# EAGLE design Schaltplan (EAGLE 9.6.2)
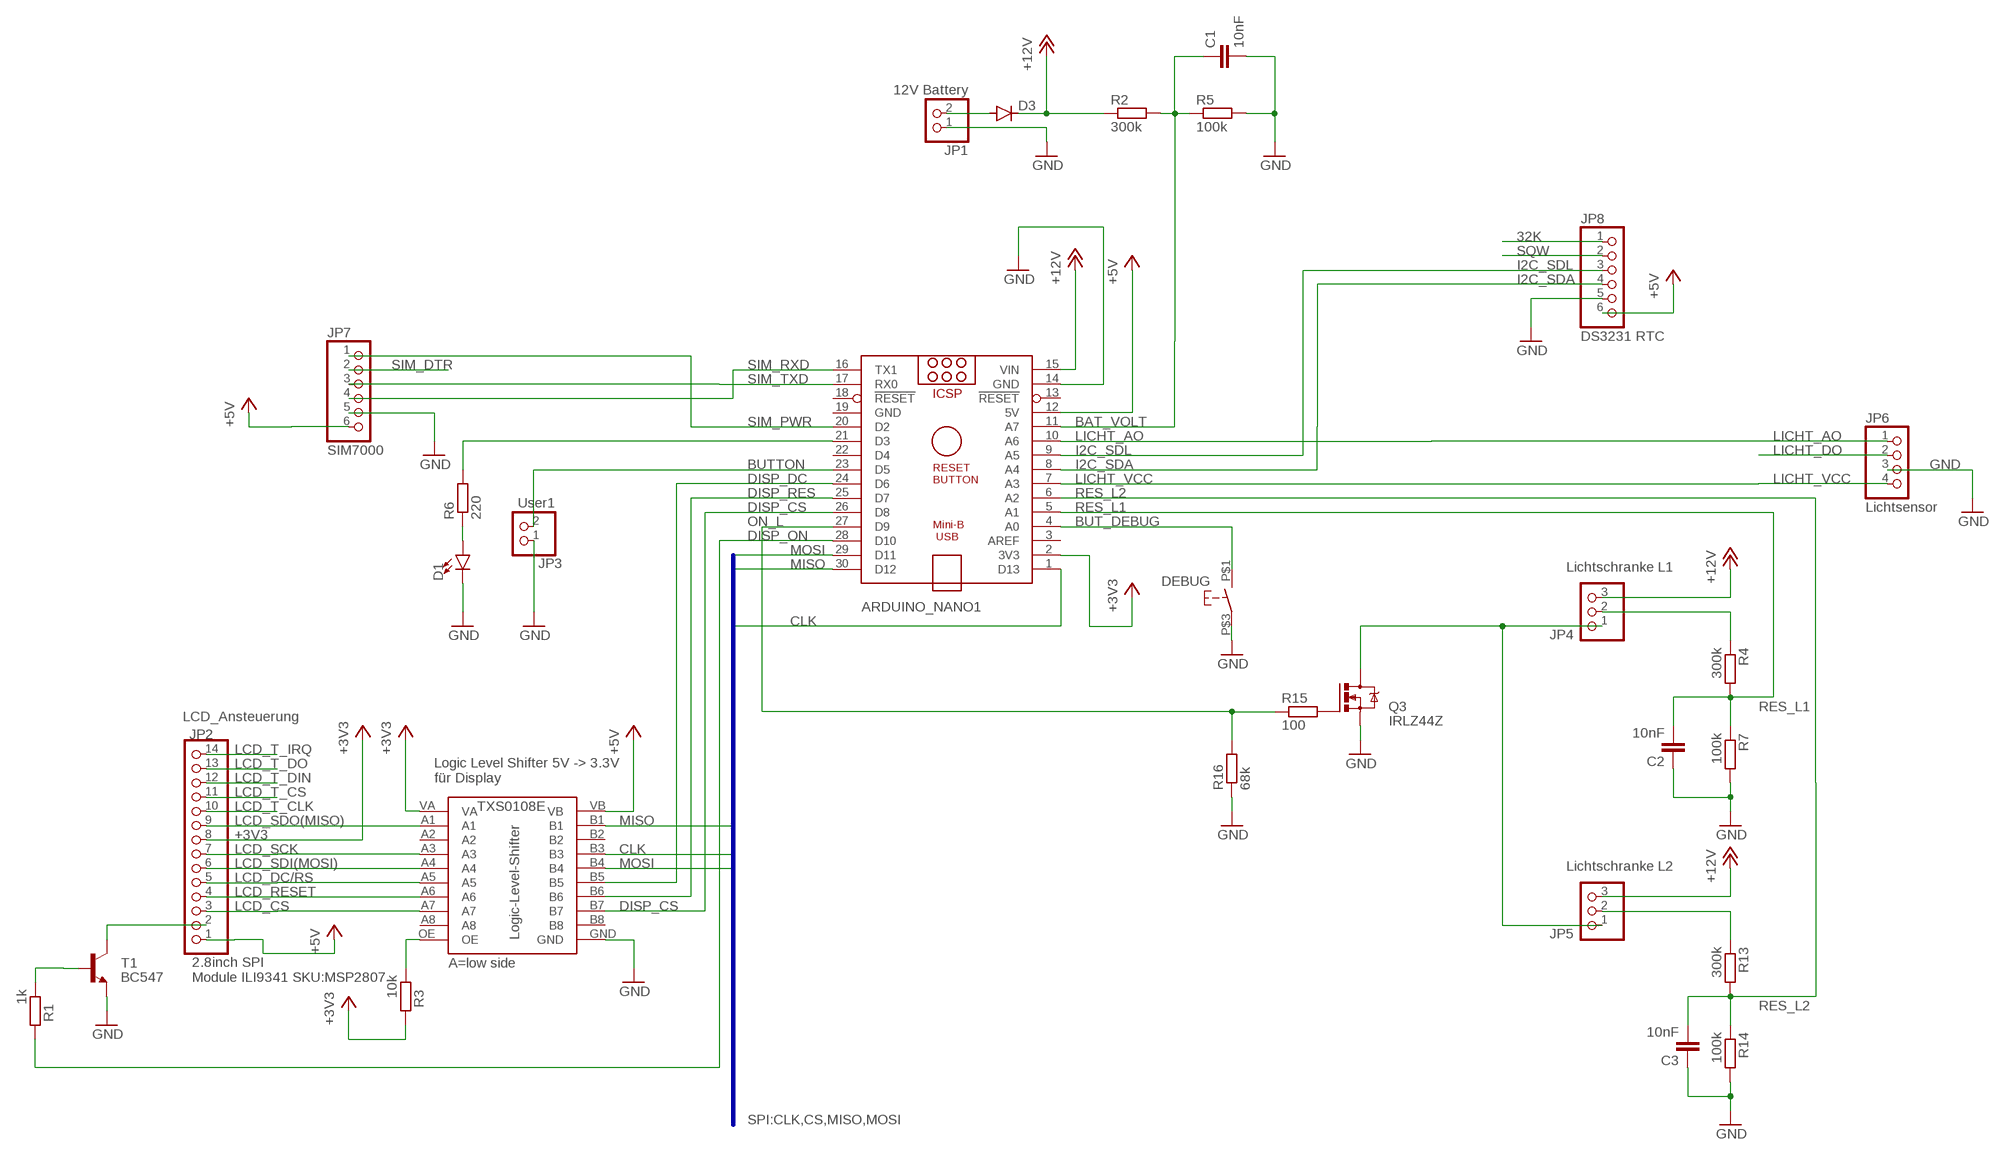
[diagram p0: schematic, sheet 1]

## Parts
ARDUINO_NANO1  ARDUINO_NANO  [ARDUINO_NANO]
C1  10nF  C-EUC0805K  [C0805K]
C2  10nF  C-EUC0805K  [C0805K]
C3  10nF  C-EUC0805K  [C0805K]
D1  LED5MM  [LED_5MM]
D3  1N4004  [DO41-10]
DEBUG  SCHLIESSER_TASTSCHALTER  [B3F-10XX]
JP1  12V Battery  PINHD-1X2  [1X02]
JP2  LCD_Ansteuerung  PINHD-1X14  [1X14]
JP3  User1  PINHD-1X2  [1X02]
JP4  Lichtschranke L1  PINHD-1X3  [1X03]
JP5  Lichtschranke L2  PINHD-1X3  [1X03]
JP6  Lichtsensor  PINHD-1X4  [1X04]
JP7  SIM7000  PINHD-1X6  [1X06]
JP8  DS3231 RTC  PINHD-1X6  [1X06]
Q3  IRLZ44Z  [TO220BH]
R1  1k  R-EU_R1206  [R1206]
R2  300k  R-EU_R1206  [R1206]
R3  10k  R-EU_R1206  [R1206]
R4  300k  R-EU_R1206  [R1206]
R5  100k  R-EU_R1206  [R1206]
R6  220  R-EU_R1206  [R1206]
R7  100k  R-EU_R1206  [R1206]
R13  300k  R-EU_R1206  [R1206]
R14  100k  R-EU_R1206  [R1206]
R15  100  R-EU_R1206  [R1206]
R16  68k  R-EU_R1206  [R1206]
T1  BC547  [TO92]
U$2  TXS0108E_LOGIC_LEVEL_SHIFTER  [TXS0108E_LOGIC_LEVEL_SHIFTER]

## Nets
32K: JP8.1
+3V3: ARDUINO_NANO1.2(3V3) JP2.8 R3.2 U$2.VA
+5V: ARDUINO_NANO1.12(5V) JP2.1 JP7.6 JP8.6 U$2.VB
+12V: ARDUINO_NANO1.15(VIN) D3.C JP4.3 JP5.3 R2.1
BAT_VOLT: ARDUINO_NANO1.11(A7) C1.1 R2.2 R5.1
BUT_DEBUG: ARDUINO_NANO1.4(A0) DEBUG.P$1
BUTTON: ARDUINO_NANO1.23(D5) JP3.2
CLK: ARDUINO_NANO1.1(D13) U$2.B3
DISP_CS: ARDUINO_NANO1.26(D8) U$2.B7
DISP_DC: ARDUINO_NANO1.24(D6) U$2.B5
DISP_ON: ARDUINO_NANO1.28(D10) R1.2
DISP_RES: ARDUINO_NANO1.25(D7) U$2.B6
GND: ARDUINO_NANO1.14(GND) C1.2 C2.1 C3.1 D1.K(C) DEBUG.P$3 JP1.1 JP3.1 JP6.3 JP7.5 JP8.5 Q3.S R5.2 R7.2 R14.2 R16.1 T1.1(E) U$2.GND
I2C_SDA: ARDUINO_NANO1.8(A4) JP8.4
I2C_SDL: ARDUINO_NANO1.9(A5) JP8.3
LCD_CS: JP2.3 U$2.A7
LCD_DC/RS: JP2.5 U$2.A5
LCD_RESET: JP2.4 U$2.A6
LCD_SCK: JP2.7 U$2.A3
LCD_SDI(MOSI): JP2.6 U$2.A4
LCD_SDO(MISO): JP2.9 U$2.A1
LCD_T_CLK: JP2.10
LCD_T_CS: JP2.11
LCD_T_DIN: JP2.12
LCD_T_DO: JP2.13
LCD_T_IRQ: JP2.14
LICHT_AO: ARDUINO_NANO1.10(A6) JP6.1
LICHT_DO: JP6.2
LICHT_VCC: ARDUINO_NANO1.7(A3) JP6.4
MISO: ARDUINO_NANO1.30(D12) U$2.B1
MOSI: ARDUINO_NANO1.29(D11) U$2.B4
N$1: JP5.2 R13.1
N$2: D3.A JP1.2
N$3: JP2.2 T1.3(C)
N$4: ARDUINO_NANO1.21(D3) R6.2
N$5: JP4.1 JP5.1 Q3.D
N$6: R1.1 T1.2(B)
N$7: D1.A R6.1
N$8: R3.1 U$2.OE
N$14: Q3.G R15.2
N$15: JP4.2 R4.1
ON_L: ARDUINO_NANO1.27(D9) R15.1 R16.2
RES_L1: ARDUINO_NANO1.5(A1) C2.2 R4.2 R7.1
RES_L2: ARDUINO_NANO1.6(A2) C3.2 R13.2 R14.1
SIM_DTR: JP7.2
SIM_PWR: ARDUINO_NANO1.20(D2) JP7.1
SIM_RXD: ARDUINO_NANO1.16(TX1) JP7.4
SIM_TXD: ARDUINO_NANO1.17(RX0) JP7.3
SQW: JP8.2
Unconnected: ARDUINO_NANO1.3(AREF) ARDUINO_NANO1.13(!RESET) ARDUINO_NANO1.18(!RESET) ARDUINO_NANO1.22(D4) U$2.A2 U$2.A8 U$2.B2 U$2.B8

## Buses
SPI:CLK,CS,MISO,MOSI

## Notes on the sheet
- Logic Level Shifter 5V -> 3.3V 
  für Display
- A=low side
- 2.8inch SPI 
  Module ILI9341 SKU:MSP2807

## Power pins joined to a net without a drawn wire
GND: ARDUINO_NANO1.19(GND)

## Library data of the parts
ARDUINO_NANO1 = ArduinoNanoV30:ARDUINO_NANO: Arduino Nano V3.0 Overview: The Arduino Nano is a small, complete, and breadboard-friendly board based on the ATmega328 (Arduino Nano 3.x) or ATmega168 (Arduino Nano 2.x). It has more or less the same functionality of the Arduino Duemilanove, but in a different package. It lacks only a DC power jack, and works with a Mini-B USB cable instead of a standard one. The Nano was designed and is being produced by Gravitech. Specifications: Microcontroller Atmel ATmega168 or ATmega328 Operating Voltage (logic level) 5 V Input Voltage (recommended) 7-12 V Input Voltage (limits) 6-20 V Digital I/O Pins 14 (of which 6 provide PWM output) Analog Input Pins 8 DC Current per I/O Pin 40 mA Flash Memory 16 KB (ATmega168) or 32 KB (ATmega328) of which 2 KB used by bootloader SRAM 1 KB (ATmega168) or 2 KB (ATmega328) EEPROM 512 bytes (ATmega168) or 1 KB (ATmega328) Clock Speed 16 MHz Dimensions 0.73" x 1.70" Length 45 mm Width 18 mm Weigth 5 g Power: The Arduino Nano can be powered via the Mini-B USB connection, 6-20V unregulated external power supply (pin 30), or 5V regulated external power supply (pin 27). The power source is automatically selected to the highest voltage source. Memory: The ATmega168 has 16 KB of flash memory for storing code (of which 2 KB is used for the bootloader); the ATmega328 has 32 KB, (also with 2 KB used for the bootloader). The ATmega168 has 1 KB of SRAM and 512 bytes of EEPROM (which can be read and written with the EEPROM library); the ATmega328 has 2 KB of SRAM and 1 KB of EEPROM. Input and Output: Each of the 14 digital pins on the Nano can be used as an input or output, using pinMode(), digitalWrite(), and digitalRead() functions. They operate at 5 volts. Each pin can provide or receive a maximum of 40 mA and has an internal pull-up resistor (disconnected by default) of 20-50 kOhms. In addition, some pins have specialized functions. Visit Arduino - ArduinoBoardNano <https://www.arduino.cc/en/Main/ArduinoBoardNano>
C1-C3 = resistor:C-EU: CAPACITOR, European symbol
D1 = SparkFun-LED:LED: LED (Generic) Standard schematic elements and footprints for 5mm, 3mm, 1206, and 0603 sized LEDs. Generic LEDs with no color specified.
D3 = diode:1N4004: DIODE general purpose rectifier, 1 A
DEBUG = 0liver:SCHLIESSER_TASTSCHALTER: Tastschalter, Schließer
JP1 JP3 = pinhead:PINHD-1X2: PIN HEADER
JP2 = pinhead:PINHD-1X14: PIN HEADER
JP4 JP5 = pinhead:PINHD-1X3: PIN HEADER
JP6 = pinhead:PINHD-1X4: PIN HEADER
JP7 JP8 = pinhead:PINHD-1X6: PIN HEADER
Q3 = transistor-power:IRLZ44Z: N-Channel HEXFET® Power MOSFET Logic Level AUTOMOTIVE MOSFET Source: http://www.irf.com/product-info/datasheets/data/irlz44zpbf.pdf
R1 R3 = rcl:R-EU_: RESISTOR, European symbol; SPICEPREFIX: R
R2 R4-R7 R13-R16 = rcl:R-EU_: RESISTOR, European symbol
T1 = transistor:BC547: NPN TRANSISTOR
U$2 = 0liver:TXS0108E_LOGIC_LEVEL_SHIFTER: Adafruit Logic Level Shifter TXS0108E

## Board
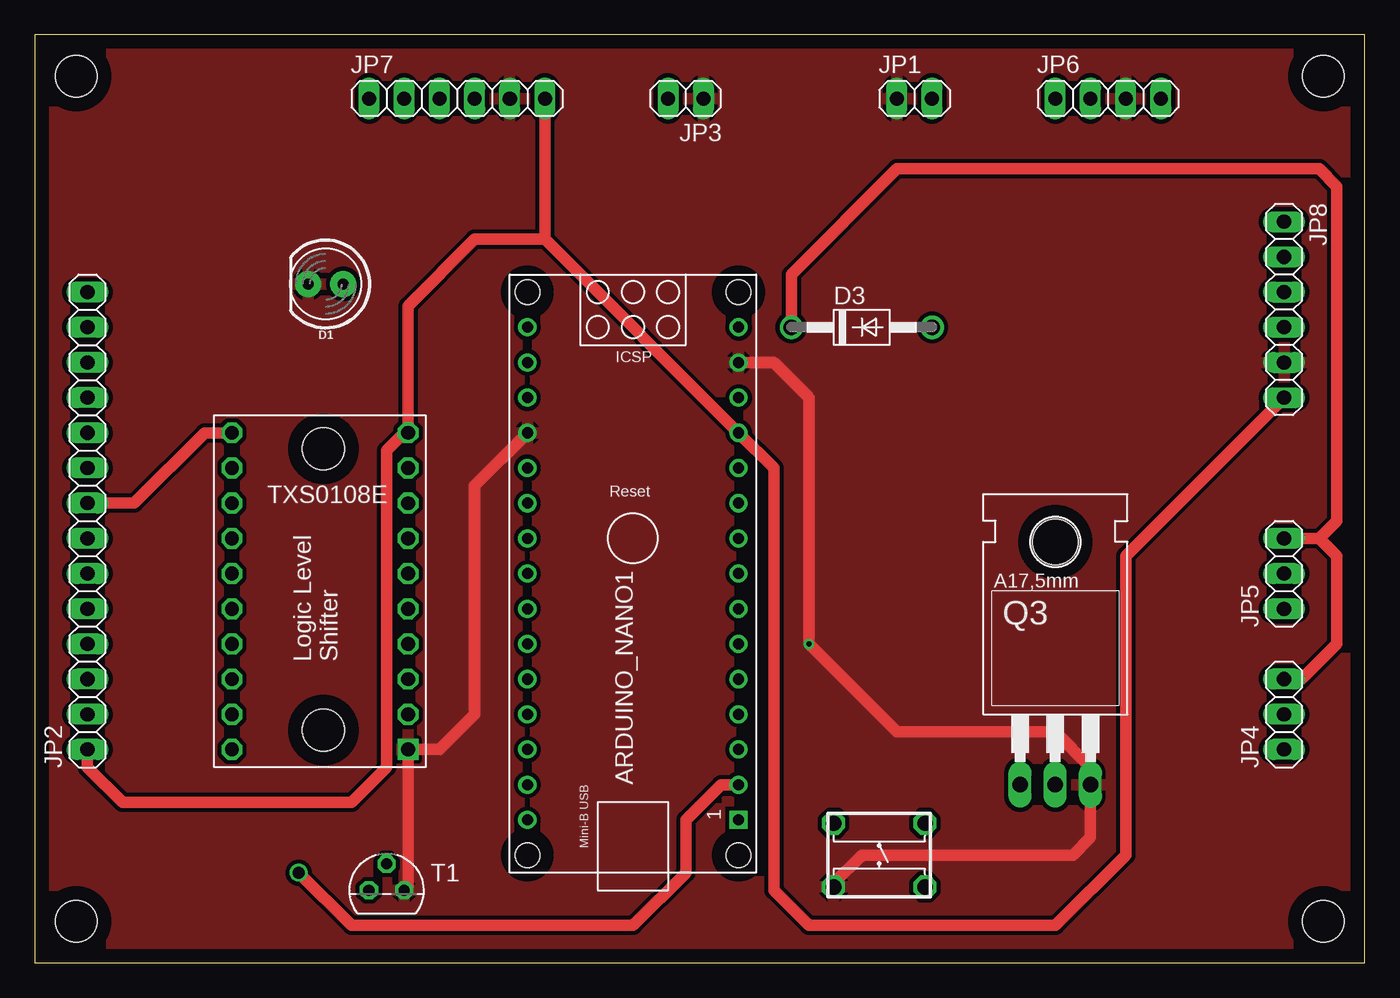
[diagram p1: board, top side]
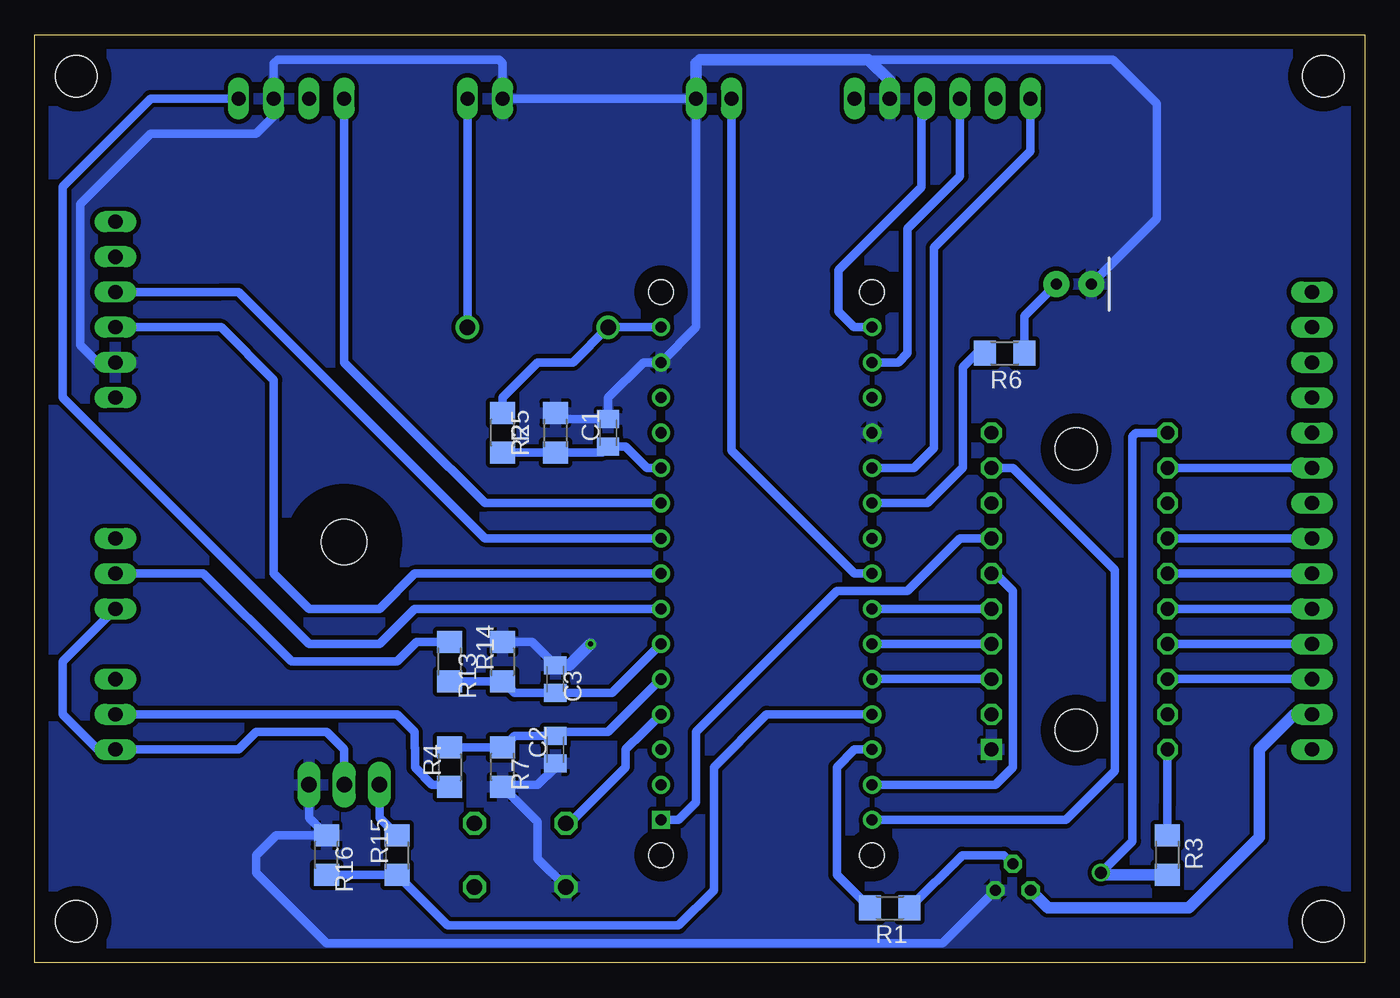
[diagram p2: board, bottom side, seen from below]

Size 96 x 67 mm. Coordinates in mm from the lower left corner, seen from the top.
Outline: 0,0 96,0 96,67 0,67 0,0
Copper layers (1*16): Top 0.035mm / dielectric 1.5mm / Bottom 0.035mm
Design rules "default *": minimum track width 6mil, minimum drill 0.35mm, track to track 12mil, track to pad 12mil, pad to pad 24mil, via to via 24mil, smd to smd 6mil, copper to edge 40mil, drill to drill 6mil, minimum pad ring 10mil, minimum via ring 8mil, stop-mask expansion 4mil, vias tented up to drill 0mil, thermal gap 10mil
Holes 3 mm at 3,64 3,3 93,3 93,64

### Footprints (pad centres in the part's own frame; a part is rotated, then mirrored left to right if it is on the bottom)
ARDUINO_NANO = drill 0.8 square: 1 -20.32,-7.62 | drill 0.8: 2 -17.78,-7.62; 3 -15.24,-7.62; 4 -12.7,-7.62; 5 -10.16,-7.62; 6 -7.62,-7.62; 7 -5.08,-7.62; 8 -2.54,-7.62; 9 0,-7.62; 10 2.54,-7.62; 11 5.08,-7.62; 12 7.62,-7.62; 13 10.16,-7.62; 14 12.7,-7.62; 15 15.24,-7.62; 16 15.24,7.62; 17 12.7,7.62; 18 10.16,7.62; 19 7.62,7.62; 20 5.08,7.62; 21 2.54,7.62; 22 0,7.62; 23 -2.54,7.62; 24 -5.08,7.62; 25 -7.62,7.62; 26 -10.16,7.62; 27 -12.7,7.62; 28 -15.24,7.62; 29 -17.78,7.62; 30 -20.32,7.62 | hole 1.778: -22.86,-7.62; -22.86,7.62; 17.78,7.62; 17.78,-7.62
C0805K = smd 1.3 x 1.6: 1 -1,0; 2 1,0
LED_5MM = drill 0.813 pad 1.88: A -1.27,0; K 1.27,0
DO41-10 = drill 1.118: A 5.08,0; C -5.08,0
B3F-10XX = drill 1.1 octagon: P$1 3.3,-2.3; P$2 -3.3,-2.3; P$3 3.3,2.3; P$4 -3.3,2.3
1X02 = drill 1.016 long: 1 -1.27,0; 2 1.27,0
1X14 = drill 1.016 long: 1 -16.51,0; 2 -13.97,0; 3 -11.43,0; 4 -8.89,0; 5 -6.35,0; 6 -3.81,0; 7 -1.27,0; 8 1.27,0; 9 3.81,0; 10 6.35,0; 11 8.89,0; 12 11.43,0; 13 13.97,0; 14 16.51,0
1X03 = drill 1.016 long: 1 -2.54,0; 2 0,0; 3 2.54,0
1X04 = drill 1.016 long: 1 -3.81,0; 2 -1.27,0; 3 1.27,0; 4 3.81,0
1X06 = drill 1.016 long: 1 -6.35,0; 2 -3.81,0; 3 -1.27,0; 4 1.27,0; 5 3.81,0; 6 6.35,0
TO220BH = drill 1.118 long: D 0,-6.35; G -2.54,-6.35; S 2.54,-6.35 | hole 3.302: 0,11.176
R1206 = smd 1.6 x 1.803: 1 -1.422,0; 2 1.422,0
TO92 = drill 0.813 octagon: 1 1.27,0; 2 0,1.905; 3 -1.27,0
TXS0108E_LOGIC_LEVEL_SHIFTER = drill 1 octagon: A1 -6.35,7.62; A2 -6.35,5.08; A3 -6.35,2.54; A4 -6.35,0; A5 -6.35,-2.54; A6 -6.35,-5.08; A7 -6.35,-7.62; A8 -6.35,-10.16; B1 6.35,7.62; B2 6.35,5.08; B3 6.35,2.54; B4 6.35,0; B5 6.35,-2.54; B6 6.35,-5.08; B7 6.35,-7.62; B8 6.35,-10.16; OE -6.35,-12.7; VA -6.35,10.16; VB 6.35,10.16 | drill 1 square: GND 6.35,-12.7 | hole 3.048: 0.254,9.017; 0.254,-11.303

### Placement (x,y rotation side)
ARDUINO_NANO1  43.18,30.64 90 top
C1  54.61,38.26 90 bottom
C2  58.42,15.4 90 bottom
C3  58.42,20.48 270 bottom
D1  21,49 180 top
D3  59.69,45.88 0 top
DEBUG  60.96,7.78 180 top
JP1  63.5,62.39 0 top
JP2  3.81,31.91 90 top
JP3  46.99,62.39 180 top
JP4  90.17,17.94 90 top
JP5  90.17,28.1 90 top
JP6  77.47,62.39 0 top
JP7  30.48,62.39 0 top
JP8  90.17,47.15 270 top
Q3  73.66,19.21 0 top
R1  34.29,3.97 180 bottom
R2  62.23,38.26 270 bottom
R3  14.24,7.78 270 bottom
R4  66.04,14.13 90 bottom
R5  58.42,38.26 90 bottom
R6  26,44 180 bottom
R7  62.23,14.13 270 bottom
R13  66.04,21.75 270 bottom
R14  62.23,21.75 90 bottom
R15  69.85,7.78 90 bottom
R16  74.93,7.78 270 bottom
T1  25.4,5.24 0 top
U$2  20.59,28.1 0 top

### Tracks (layer width: path | path; a pad name or v marks a point on that pad's centre or on a via)
+3V3  (via drill 0.85)
  Top 0.813: v19.05,6.51 22.86,2.7 43.18,2.7 46.99,6.51 46.99,10.32 49.53,12.86 ARDUINO_NANO1.2 | JP2.8 7.18,33.18 12.26,38.26 U$2.VA
  Bottom 0.61: v19.05,6.51 16.78,8.78 16.78,37.99 16.51,38.26 U$2.VA
  Bottom 0.813: R3.2 18.9,6.36 v19.05,6.51
+5V
  Top 0.813: JP8.6 78.74,29.37 78.74,7.78 73.66,2.7 55.88,2.7 53.34,5.24 53.34,35.72 ARDUINO_NANO1.12 36.83,52.23 | JP7.6 36.83,52.23 | 36.83,52.23 31.75,52.23 26.94,47.42 U$2.VB 26.67,38.26 25.4,36.99 25.4,14.13 22.86,11.59 6.35,11.59 3.81,14.13 JP2.1
+12V
  Top 0.813: 92.71,30.64 93.98,31.91 93.98,56.04 92.71,57.31 82.55,57.31 62.23,57.31 54.61,49.69 D3.C | JP5.3 92.71,30.64 | 92.71,30.64 93.98,29.37 93.98,23.02 91.44,20.48 JP4.3
  Bottom 0.61: ARDUINO_NANO1.15 D3.C 57.15,43.34 59.69,43.34 62.23,40.8 R2.1 | R2.1 62.23,39.53 R2.1
BAT_VOLT
  Bottom 0.61: ARDUINO_NANO1.11 51.8,35.72 53.34,37.26 C1.1 55.03,36.84 R5.1 R2.2
BUT_DEBUG
  Bottom 0.61: ARDUINO_NANO1.4 52.07,16.67 53.34,15.4 53.34,14.13 57.39,10.08 DEBUG.P$1
BUTTON
  Bottom 0.61: ARDUINO_NANO1.23 36.83,28.1 45.72,36.99 JP3.2
CLK
  Bottom 0.61: U$2.B3 29.21,30.64 33.02,26.83 38.1,26.83 48.26,16.67 48.26,11.59 49.53,10.32 ARDUINO_NANO1.1
DISP_CS
  Bottom 0.61: ARDUINO_NANO1.26 U$2.B7
DISP_DC
  Bottom 0.61: ARDUINO_NANO1.24 U$2.B5
DISP_ON
  Bottom 0.61: R1.2 38.1,6.36 38.1,14.13 36.83,15.4 ARDUINO_NANO1.28
DISP_RES
  Bottom 0.61: ARDUINO_NANO1.25 U$2.B6
GND  (via drill 0.35)
  Top 0.813: DEBUG.P$3 57.66,5.75 59.69,7.78 74.93,7.78 76.2,9.05 Q3.S 76.2,14.13 73.66,16.67 62.23,16.67 v55.88,23.02 55.88,40.8 53.34,43.34 ARDUINO_NANO1.14 | ARDUINO_NANO1.19 31.75,34.45 31.75,17.94 29.21,15.4 U$2.GND 26.94,5.51 T1.1
  Bottom 0.61: C2.1 58.42,14.13 59.69,12.86 62.08,12.86 R7.2 59.69,10.17 59.69,7.51 DEBUG.P$3 | R14.2 60.11,23.17 C3.1 | R5.2 58,39.26 C1.2 54.61,40.8 52.07,43.34 ARDUINO_NANO1.14 48.26,45.88 JP3.1 JP1.1 62.23,64.93 62.5,65.2 78.47,65.2 78.74,64.93 JP6.3 78.74,61.12 80.01,59.85 87.63,59.85 92.71,54.77 92.71,44.61 91.44,43.34 JP8.5 | Q3.S 76.2,10.47 R16.1 78.59,9.2 80.01,7.78 80.01,6.51 74.93,1.43 30.48,1.43 T1.1 | D1.K 15,53.73 15,62 18.2,65.2 36,65.2
  Bottom 0.813: C3.1 57.42,21.48 v55.88,23.02 | JP7.5 34.29,63.66 35.83,65.2 36,65.2 47.99,65.2 48.26,64.93 JP3.1
  pour Top: 0,67 96,67 96,0 0,0
  pour Bottom: 0,67 96,67 96,0 0,0
I2C_SDA
  Bottom 0.61: ARDUINO_NANO1.8 68.58,28.1 71.12,25.56 76.2,25.56 78.74,28.1 78.74,42.07 82.55,45.88 JP8.4
I2C_SDL
  Bottom 0.61: ARDUINO_NANO1.9 63.5,30.64 81.28,48.42 82.55,48.42 JP8.3
LCD_CS
  Bottom 0.61: U$2.A7 JP2.3
LCD_DC/RS
  Bottom 0.61: U$2.A5 JP2.5
LCD_RESET
  Bottom 0.61: U$2.A6 JP2.4
LCD_SCK
  Bottom 0.61: U$2.A3 JP2.7
LCD_SDI(MOSI)
  Bottom 0.61: U$2.A4 JP2.6
LCD_SDO(MISO)
  Bottom 0.61: U$2.A1 JP2.9
LICHT_AO
  Bottom 0.61: ARDUINO_NANO1.10 63.5,33.18 68.58,38.26 73.66,43.34 JP6.1
LICHT_VCC
  Bottom 0.61: ARDUINO_NANO1.7 68.58,25.56 71.12,23.02 76.2,23.02 93.98,40.8 93.98,56.04 87.63,62.39 JP6.4
MISO
  Bottom 0.61: ARDUINO_NANO1.30 21.59,10.32 18.05,13.86 18.05,28.37 25.4,35.72 U$2.B1
MOSI
  Bottom 0.61: U$2.B4 26.67,28.1 25.4,26.83 25.4,14.13 26.67,12.86 ARDUINO_NANO1.29
N$1
  Bottom 0.61: JP5.2 83.82,28.1 77.47,21.75 69.85,21.75 68.43,23.17 R13.1
N$2
  Bottom 0.61: D3.A 64.77,50.96 JP1.2
N$3
  Bottom 0.813: JP2.2 5.08,17.94 7.62,15.4 7.62,9.05 12.7,3.97 22.86,3.97 T1.3
N$4
  Bottom 0.61: ARDUINO_NANO1.21 31.56,33.18 29,35.74 29,43 28,44 R6.2
N$5
  Bottom 0.61: JP5.1 93.98,21.75 93.98,17.94 91.44,15.4 JP4.1 81.28,15.4 80.01,16.67 74.93,16.67 73.66,15.4 Q3.D
N$6
  Bottom 0.61: R1.1 29.06,7.78 26.04,7.78 T1.2
N$7
  Bottom 0.61: R6.1 24.58,46.69 D1.A
N$8
  Bottom 0.61: R3.1 14.24,11.47 U$2.OE
N$14
  Bottom 0.61: Q3.G 71.12,10.47 R15.2
N$15
  Bottom 0.61: R4.1 66.19,12.86 67.31,12.86 68.56,14.11 68.56,15.5 68.58,15.53 68.58,16.67 69.85,17.94 JP4.2
ON_L
  Bottom 0.61: R16.2 R15.1 66.19,2.7 49.53,2.7 46.99,5.24 46.99,14.13 43.18,17.94 ARDUINO_NANO1.27
POT_FREE
  pour Bottom: 0,67 96,67 96,0 0,0
RES_L1
  Bottom 0.61: ARDUINO_NANO1.5 54.61,16.67 58.15,16.67 C2.2 61.38,16.4 R7.1 R4.2
RES_L2
  Bottom 0.61: ARDUINO_NANO1.6 54.34,19.48 C3.2 61.38,19.48 R14.1 R13.2
SIM_PWR
  Bottom 0.61: ARDUINO_NANO1.20 32.56,35.72 31.1,37.18 31.1,51.61 24.13,58.58 JP7.1
SIM_RXD
  Bottom 0.61: 31.75,61.12 JP7.4 32,62.14 32,56 38,50 38,47 36.88,45.88 ARDUINO_NANO1.16
SIM_TXD
  Bottom 0.61: ARDUINO_NANO1.17 33.66,43.34 33,44 33,53 29.21,56.79 JP7.3